# EAGLE schematic boardv2battery (EAGLE 6.6.0)

## Sheet 1 of 4
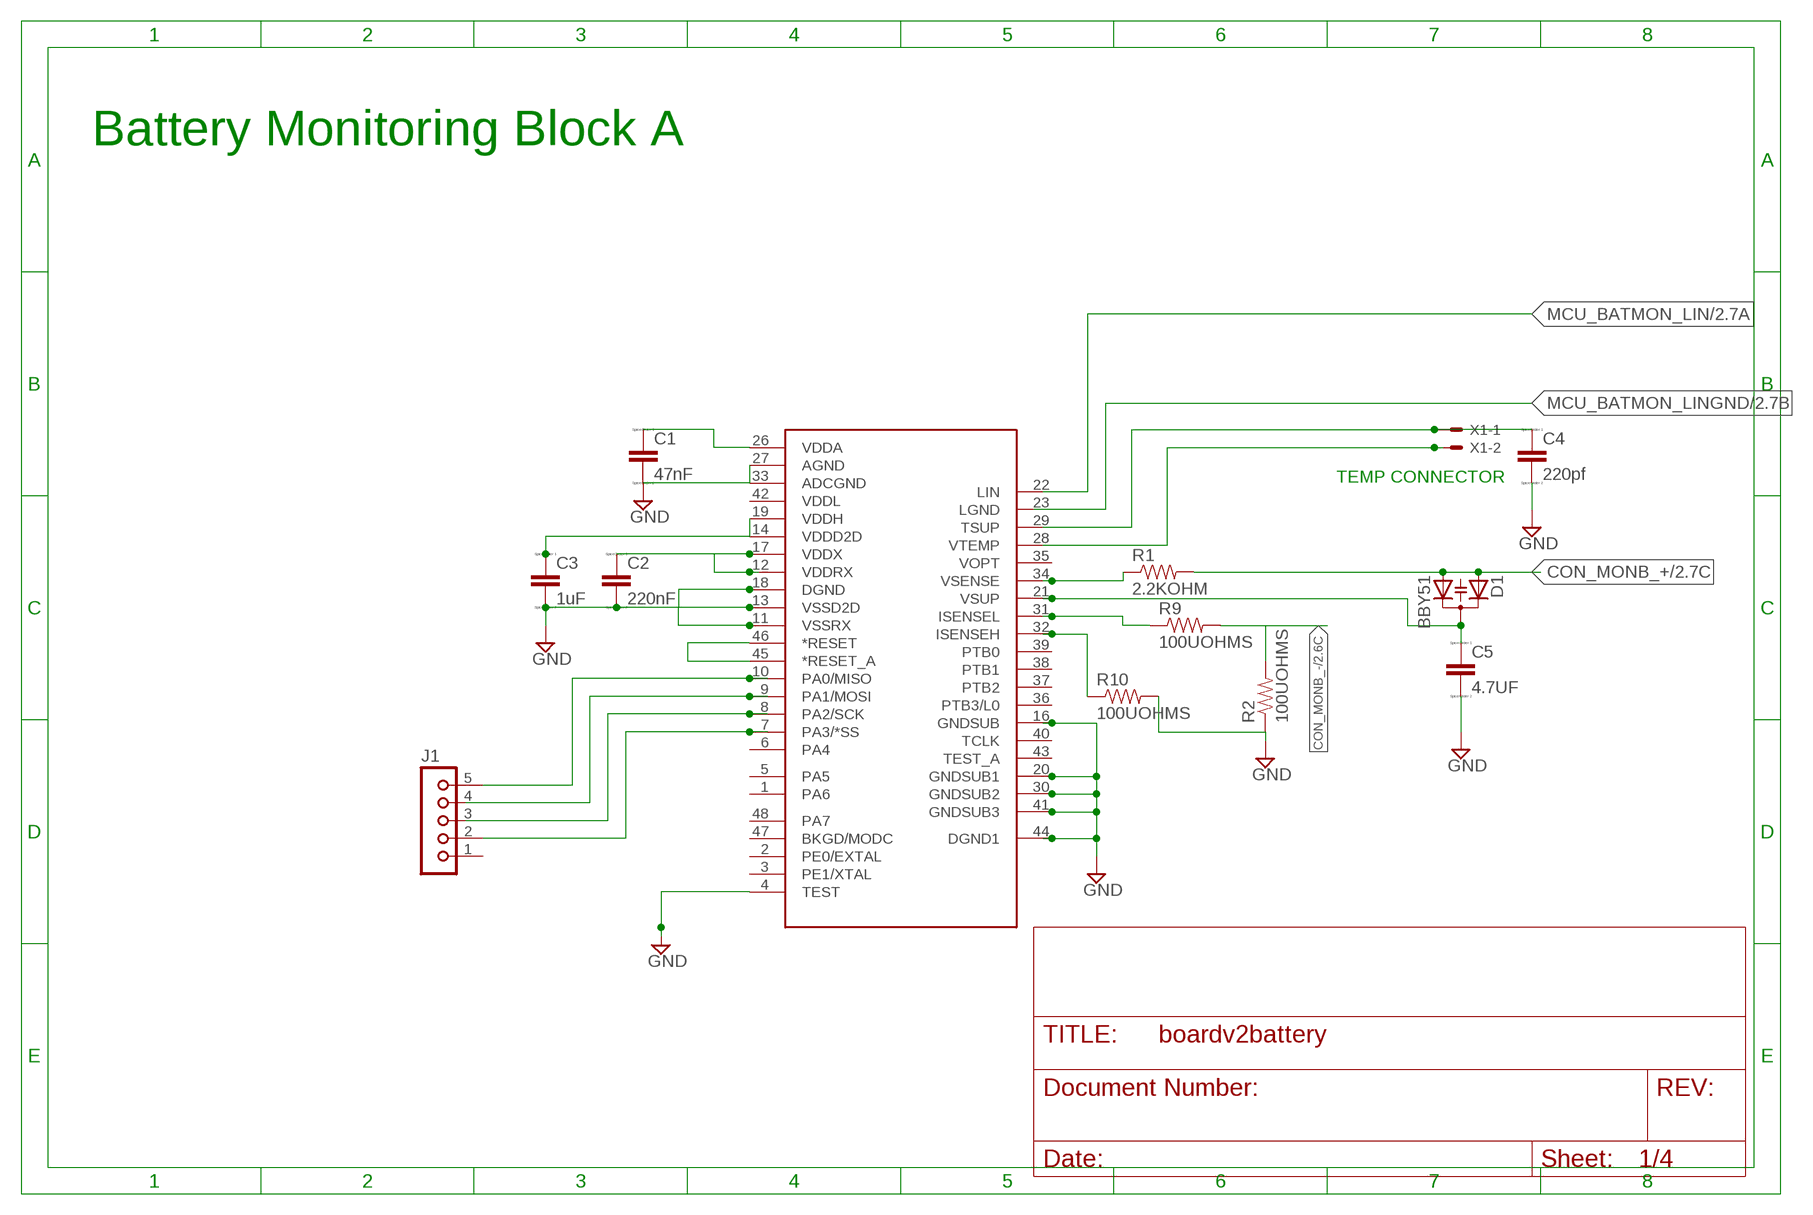
[diagram p0: schematic, sheet 1]

### Parts
C1  47nF  CC0603  [C0603]
C2  220nF  CC0603  [C0603]
C3  1uF  CC0603  [C0603]
C4  220pf  CC0603  [C0603]
C5  4.7UF  CC0603  [C0603]
D1  BBY51  [SOT23]
J1  JU05  [JU05]
R1  2.2KOHM  RESISTOR0603-RES  [0603-RES]
R2  100UOHMS  RESISTOR0603-RES  [0603-RES]
R9  100UOHMS  RESISTOR0603-RES  [0603-RES]
R10  100UOHMS  RESISTOR0603-RES  [0603-RES]
U$1  MM912_637D1  [QFN48]
X1  KK-156-2  [KK-156-2]

### Nets
CON_MONB_+: D1.1(A1) D1.2(A2) R1.2 ; also sheet 2
CON_MONB_-: R2.2 R9.2 ; also sheet 2
GND: C1.2 C2.2 C3.2 C4.2 C5.2 R2.1 R10.2 U$1.4(TEST) U$1.11(VSSRX) U$1.13(VSSD2D) U$1.16(GNDSUB) U$1.18(DGND) U$1.20(GNDSUB1) U$1.27(AGND) U$1.30(GNDSUB2) U$1.41(GNDSUB3) U$1.44(DGND1) ; also sheet 2,3,4
N$2: C2.1 U$1.12(VDDRX) U$1.17(VDDX)
N$3: C5.1 D1.3(C) U$1.21(VSUP)
N$4: J1.5 U$1.10(PA0/MISO)
N$5: U$1.9(PA1/MOSI)
N$6: U$1.8(PA2/SCK)
N$7: J1.2 U$1.7(PA3/*SS)
N$8: U$1.45(*RESET_A) U$1.46(*RESET)
N$10: R1.1 U$1.34(VSENSE)
N$11: C4.1 X1.1
N$12: X1.2
N$45: R10.1 U$1.32(ISENSEH)
N$46: R9.1 U$1.31(ISENSEL)
N$47: C1.1 U$1.26(VDDA)
N$48: C3.1 U$1.14(VDDD2D) U$1.19(VDDH)
Unconnected: J1.1 J1.3 J1.4 U$1.1(PA6) U$1.2(PE0/EXTAL) U$1.3(PE1/XTAL) U$1.5(PA5) U$1.6(PA4) U$1.22(LIN) U$1.23(LGND) U$1.28(VTEMP) U$1.29(TSUP) U$1.33(ADCGND) U$1.35(VOPT) U$1.36(PTB3/L0) U$1.37(PTB2) U$1.38(PTB1) U$1.39(PTB0) U$1.40(TCLK) U$1.42(VDDL) U$1.43(TEST_A) U$1.47(BKGD/MODC) U$1.48(PA7)

### Notes on the sheet
- Battery Monitoring Block A
- TEMP CONNECTOR

## Sheet 2 of 4
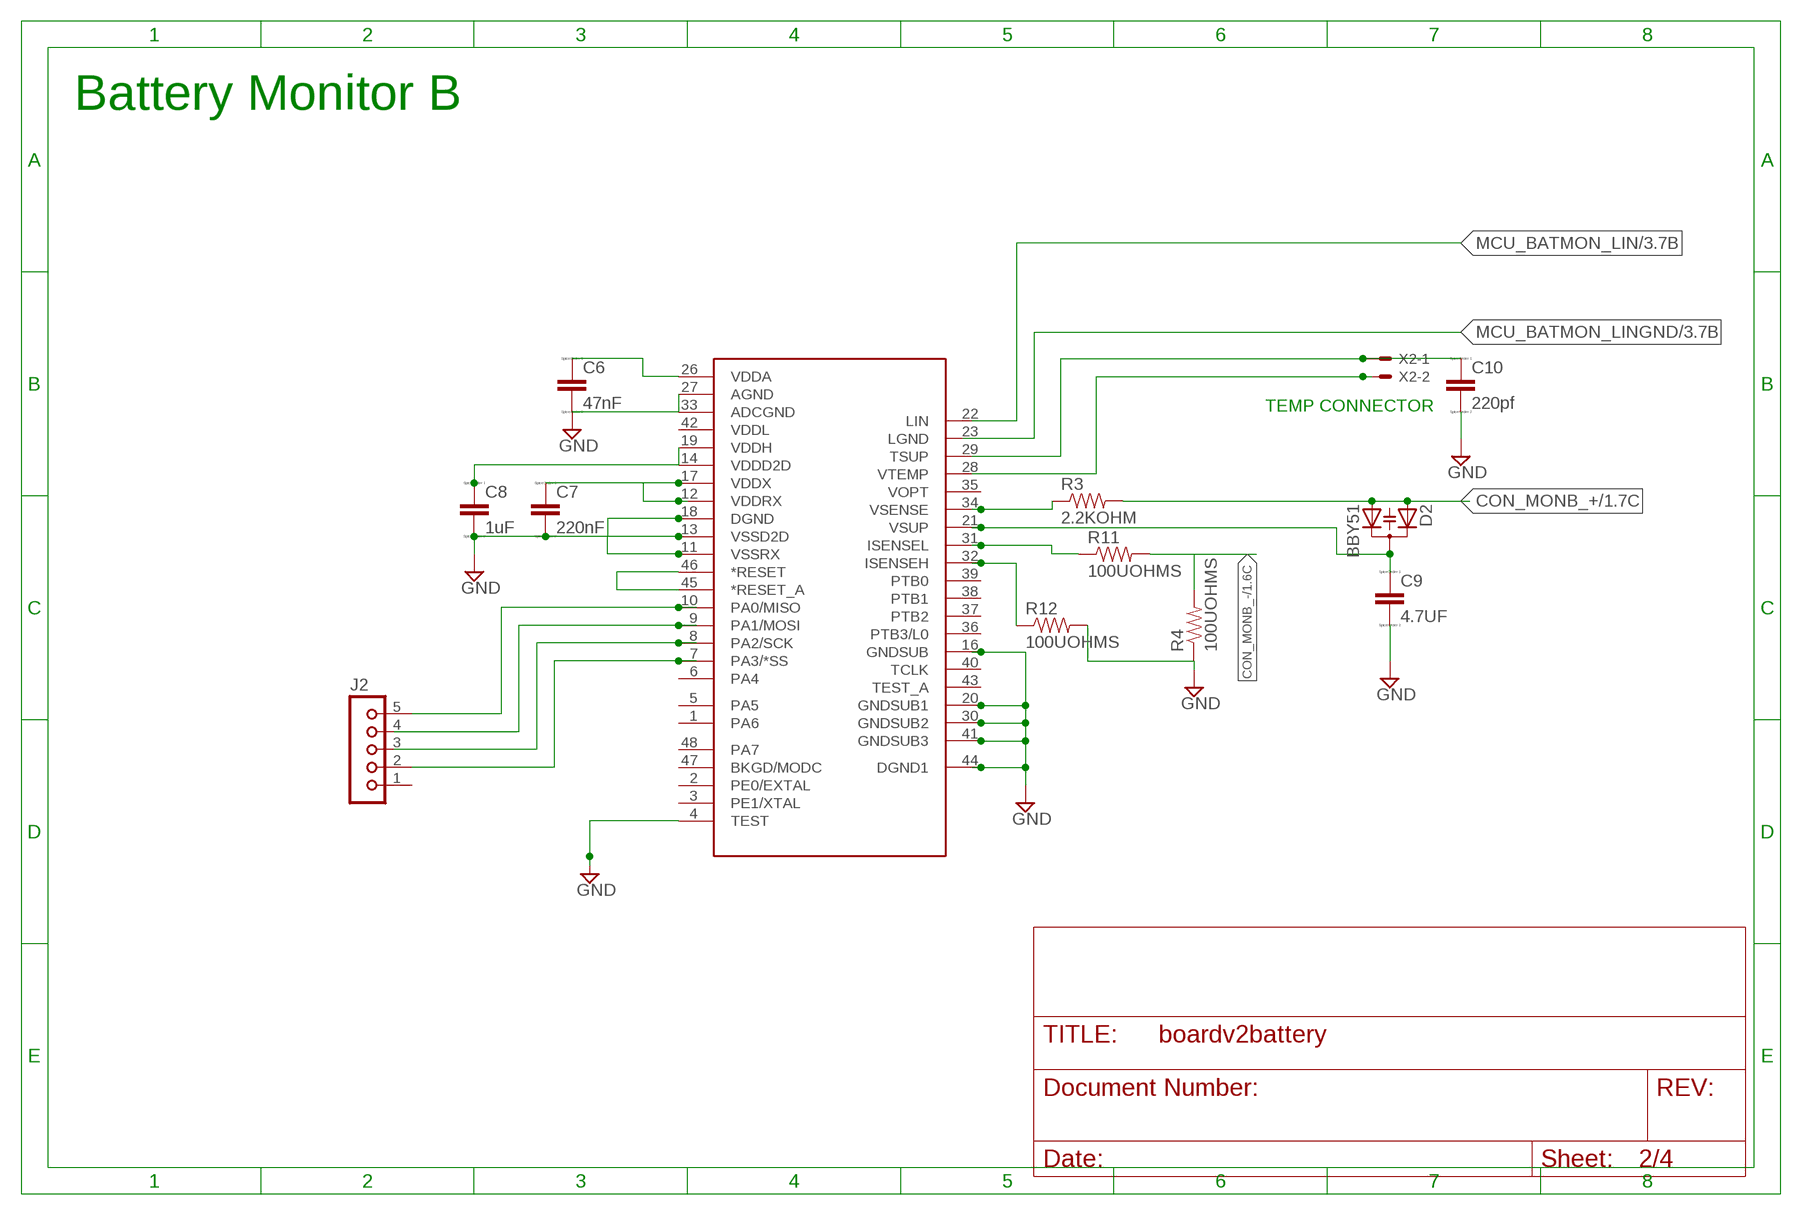
[diagram p1: schematic, sheet 2]

### Parts
C6  47nF  CC0603  [C0603]
C7  220nF  CC0603  [C0603]
C8  1uF  CC0603  [C0603]
C9  4.7UF  CC0603  [C0603]
C10  220pf  CC0603  [C0603]
D2  BBY51  [SOT23]
J2  JU05  [JU05]
R3  2.2KOHM  RESISTOR0603-RES  [0603-RES]
R4  100UOHMS  RESISTOR0603-RES  [0603-RES]
R11  100UOHMS  RESISTOR0603-RES  [0603-RES]
R12  100UOHMS  RESISTOR0603-RES  [0603-RES]
U$2  MM912_637D1  [QFN48]
X2  KK-156-2  [KK-156-2]

### Nets
CON_MONB_+: D2.1(A1) D2.2(A2) R3.2 ; also sheet 1
CON_MONB_-: R4.2 R11.2 ; also sheet 1
GND: C6.2 C7.2 C8.2 C9.2 C10.2 R4.1 R12.2 U$2.4(TEST) U$2.11(VSSRX) U$2.13(VSSD2D) U$2.16(GNDSUB) U$2.18(DGND) U$2.20(GNDSUB1) U$2.27(AGND) U$2.30(GNDSUB2) U$2.41(GNDSUB3) U$2.44(DGND1) ; also sheet 1,3,4
N$1: C9.1 D2.3(C) U$2.21(VSUP)
N$9: J2.5 U$2.10(PA0/MISO)
N$13: U$2.9(PA1/MOSI)
N$14: U$2.8(PA2/SCK)
N$15: J2.2 U$2.7(PA3/*SS)
N$16: R3.1 U$2.34(VSENSE)
N$17: C7.1 U$2.12(VDDRX) U$2.17(VDDX)
N$18: C10.1 X2.1
N$19: X2.2
N$20: U$2.45(*RESET_A) U$2.46(*RESET)
N$21: R12.1 U$2.32(ISENSEH)
N$22: C6.1 U$2.26(VDDA)
N$49: R11.1 U$2.31(ISENSEL)
N$50: C8.1 U$2.14(VDDD2D) U$2.19(VDDH)
Unconnected: J2.1 J2.3 J2.4 U$2.1(PA6) U$2.2(PE0/EXTAL) U$2.3(PE1/XTAL) U$2.5(PA5) U$2.6(PA4) U$2.22(LIN) U$2.23(LGND) U$2.28(VTEMP) U$2.29(TSUP) U$2.33(ADCGND) U$2.35(VOPT) U$2.36(PTB3/L0) U$2.37(PTB2) U$2.38(PTB1) U$2.39(PTB0) U$2.40(TCLK) U$2.42(VDDL) U$2.43(TEST_A) U$2.47(BKGD/MODC) U$2.48(PA7)

### Notes on the sheet
- Battery Monitor B
- TEMP CONNECTOR

## Sheet 3 of 4
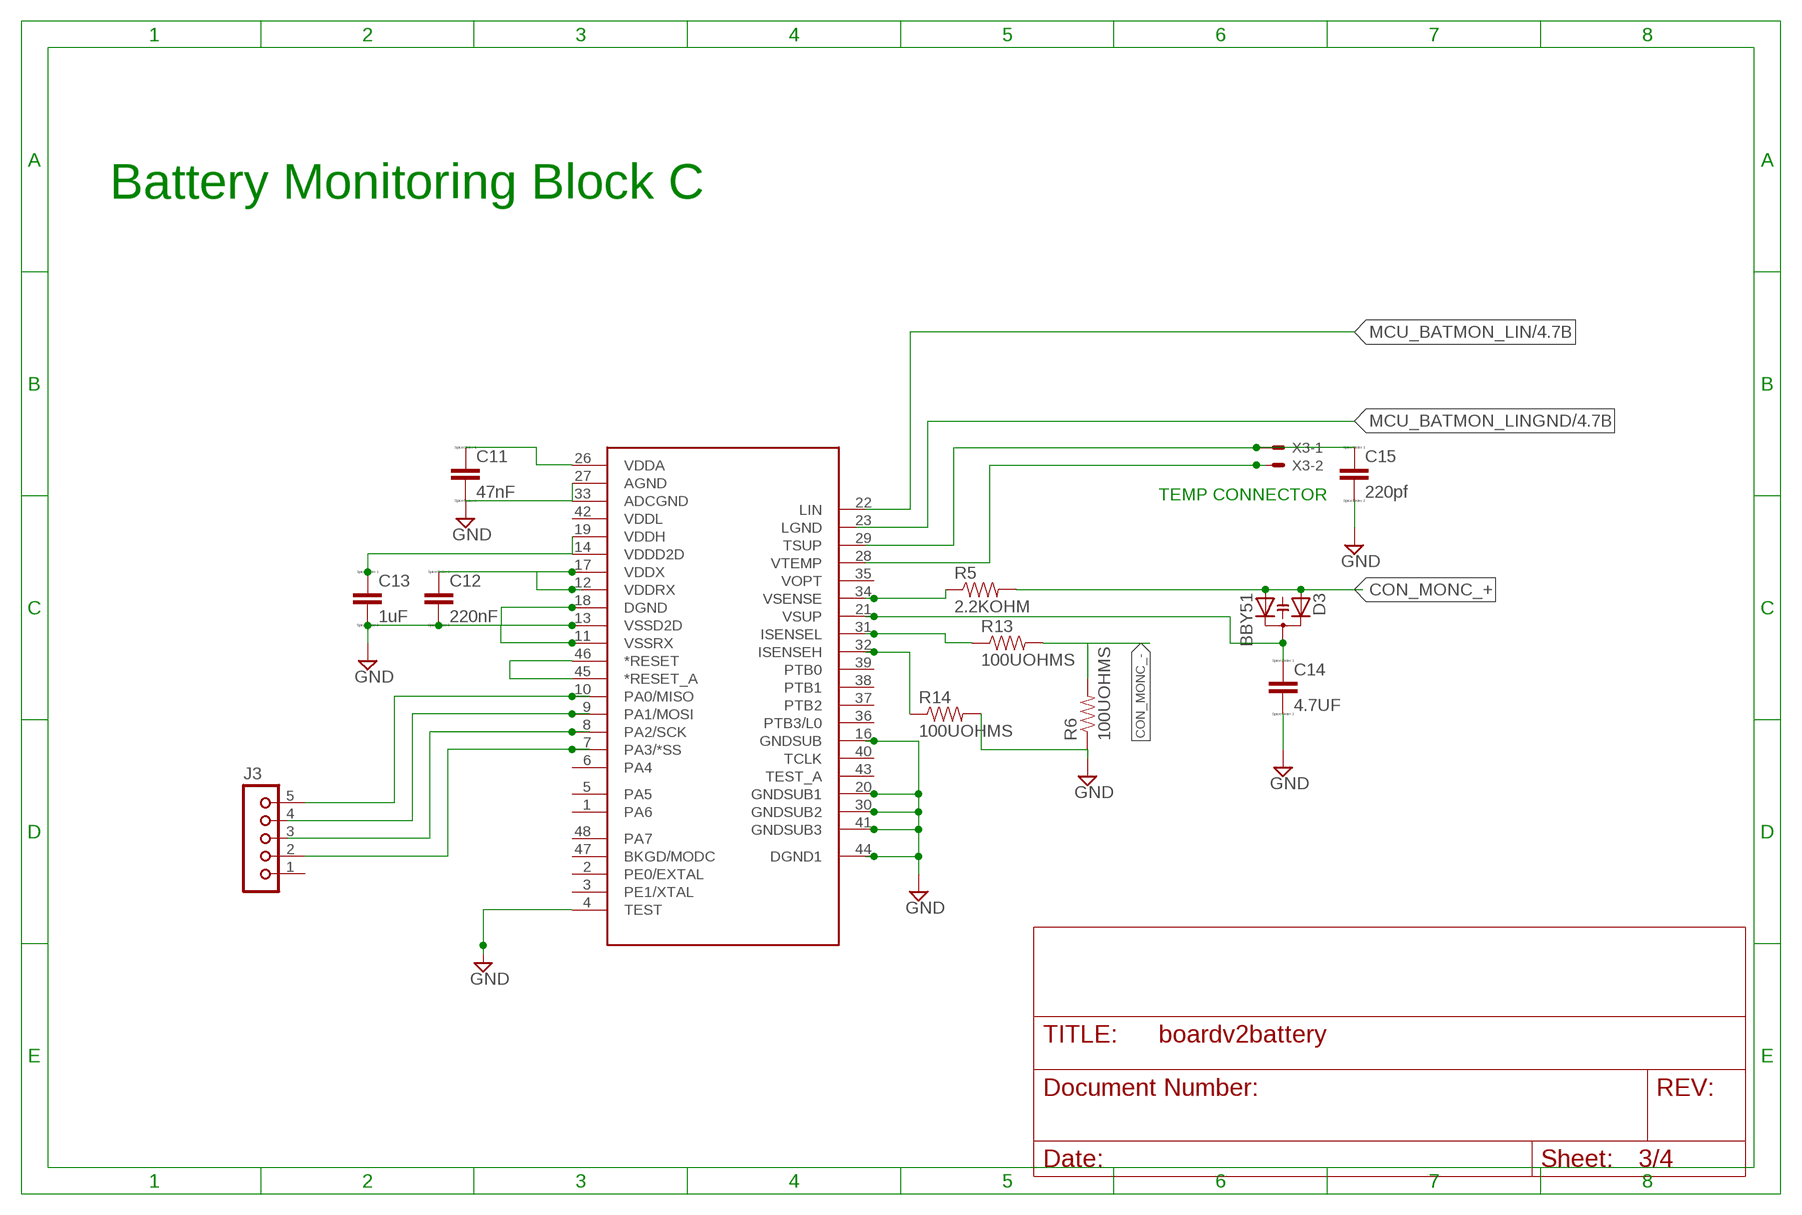
[diagram p2: schematic, sheet 3]

### Parts
C11  47nF  CC0603  [C0603]
C12  220nF  CC0603  [C0603]
C13  1uF  CC0603  [C0603]
C14  4.7UF  CC0603  [C0603]
C15  220pf  CC0603  [C0603]
D3  BBY51  [SOT23]
J3  JU05  [JU05]
R5  2.2KOHM  RESISTOR0603-RES  [0603-RES]
R6  100UOHMS  RESISTOR0603-RES  [0603-RES]
R13  100UOHMS  RESISTOR0603-RES  [0603-RES]
R14  100UOHMS  RESISTOR0603-RES  [0603-RES]
U$3  MM912_637D1  [QFN48]
X3  KK-156-2  [KK-156-2]

### Nets
CON_MONC_+: D3.1(A1) D3.2(A2) R5.2
CON_MONC_-: R6.2 R13.2
GND: C11.2 C12.2 C13.2 C14.2 C15.2 R6.1 R14.2 U$3.4(TEST) U$3.11(VSSRX) U$3.13(VSSD2D) U$3.16(GNDSUB) U$3.18(DGND) U$3.20(GNDSUB1) U$3.27(AGND) U$3.30(GNDSUB2) U$3.41(GNDSUB3) U$3.44(DGND1) ; also sheet 1,2,4
N$23: C14.1 D3.3(C) U$3.21(VSUP)
N$24: J3.5 U$3.10(PA0/MISO)
N$25: U$3.9(PA1/MOSI)
N$26: U$3.8(PA2/SCK)
N$27: J3.2 U$3.7(PA3/*SS)
N$28: R5.1 U$3.34(VSENSE)
N$29: C12.1 U$3.12(VDDRX) U$3.17(VDDX)
N$30: C15.1 X3.1
N$31: X3.2
N$32: U$3.45(*RESET_A) U$3.46(*RESET)
N$33: R14.1 U$3.32(ISENSEH)
N$51: C11.1 U$3.26(VDDA)
N$52: R13.1 U$3.31(ISENSEL)
N$53: C13.1 U$3.14(VDDD2D) U$3.19(VDDH)
Unconnected: J3.1 J3.3 J3.4 U$3.1(PA6) U$3.2(PE0/EXTAL) U$3.3(PE1/XTAL) U$3.5(PA5) U$3.6(PA4) U$3.22(LIN) U$3.23(LGND) U$3.28(VTEMP) U$3.29(TSUP) U$3.33(ADCGND) U$3.35(VOPT) U$3.36(PTB3/L0) U$3.37(PTB2) U$3.38(PTB1) U$3.39(PTB0) U$3.40(TCLK) U$3.42(VDDL) U$3.43(TEST_A) U$3.47(BKGD/MODC) U$3.48(PA7)

### Notes on the sheet
- Battery Monitoring Block C
- TEMP CONNECTOR

## Sheet 4 of 4
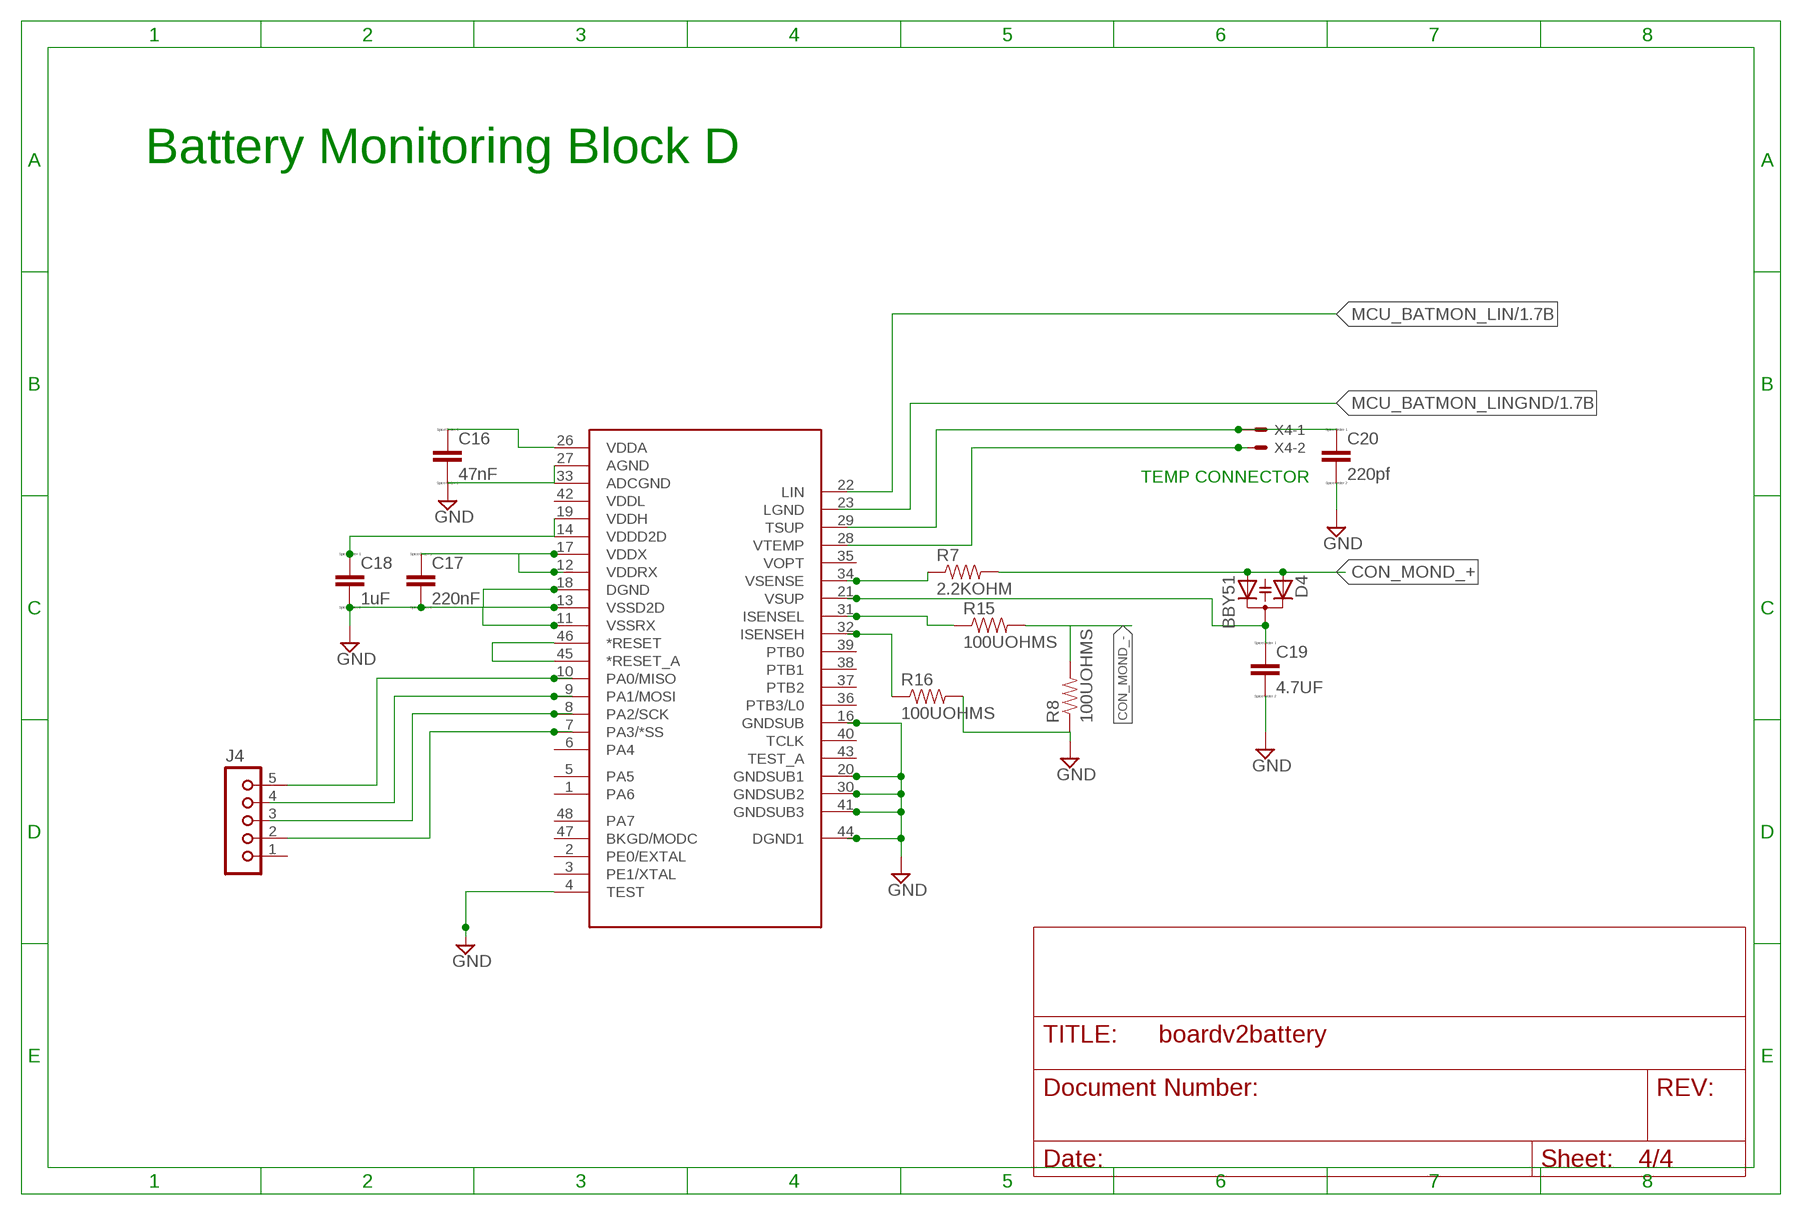
[diagram p3: schematic, sheet 4]

### Parts
C16  47nF  CC0603  [C0603]
C17  220nF  CC0603  [C0603]
C18  1uF  CC0603  [C0603]
C19  4.7UF  CC0603  [C0603]
C20  220pf  CC0603  [C0603]
D4  BBY51  [SOT23]
J4  JU05  [JU05]
R7  2.2KOHM  RESISTOR0603-RES  [0603-RES]
R8  100UOHMS  RESISTOR0603-RES  [0603-RES]
R15  100UOHMS  RESISTOR0603-RES  [0603-RES]
R16  100UOHMS  RESISTOR0603-RES  [0603-RES]
U$4  MM912_637D1  [QFN48]
X4  KK-156-2  [KK-156-2]

### Nets
CON_MOND_+: D4.1(A1) D4.2(A2) R7.2
CON_MOND_-: R8.2 R15.2
GND: C16.2 C17.2 C18.2 C19.2 C20.2 R8.1 R16.2 U$4.4(TEST) U$4.11(VSSRX) U$4.13(VSSD2D) U$4.16(GNDSUB) U$4.18(DGND) U$4.20(GNDSUB1) U$4.27(AGND) U$4.30(GNDSUB2) U$4.41(GNDSUB3) U$4.44(DGND1) ; also sheet 1,2,3
N$34: C19.1 D4.3(C) U$4.21(VSUP)
N$35: J4.5 U$4.10(PA0/MISO)
N$36: U$4.9(PA1/MOSI)
N$37: U$4.8(PA2/SCK)
N$38: J4.2 U$4.7(PA3/*SS)
N$39: R7.1 U$4.34(VSENSE)
N$40: C17.1 U$4.12(VDDRX) U$4.17(VDDX)
N$41: C20.1 X4.1
N$42: X4.2
N$43: U$4.45(*RESET_A) U$4.46(*RESET)
N$44: R16.1 U$4.32(ISENSEH)
N$54: C16.1 U$4.26(VDDA)
N$55: R15.1 U$4.31(ISENSEL)
N$56: C18.1 U$4.14(VDDD2D) U$4.19(VDDH)
Unconnected: J4.1 J4.3 J4.4 U$4.1(PA6) U$4.2(PE0/EXTAL) U$4.3(PE1/XTAL) U$4.5(PA5) U$4.6(PA4) U$4.22(LIN) U$4.23(LGND) U$4.28(VTEMP) U$4.29(TSUP) U$4.33(ADCGND) U$4.35(VOPT) U$4.36(PTB3/L0) U$4.37(PTB2) U$4.38(PTB1) U$4.39(PTB0) U$4.40(TCLK) U$4.42(VDDL) U$4.43(TEST_A) U$4.47(BKGD/MODC) U$4.48(PA7)

### Notes on the sheet
- Battery Monitoring Block D
- TEMP CONNECTOR

## Library data of the parts
C1-C20 = eagle-ltspice:C: CAPACITOR, European symbol; SPICEMODEL: NONE; SPICEPREFIX: C
D1-D4 = diode:BBY51: Capacity DIODE variable-capacitance diode (Infineon)
J1-J4 = con-lsta:JU05: PIN HEADER; OC_FARNELL: unknown; OC_NEWARK: unknown
R1-R16 = SparkFun-Passives:RESISTOR: Resistor Basic schematic elements and footprints for 0603, 1206, and PTH resistors.
U$1-U$4 = freescalemod:MM912_637D1
X1-X4 = con-molex:KK-156-2: KK 156 HEADER Source: http://www.molex.com/pdm_docs/sd/026604100_sd.pdf; OC_FARNELL: unknown; OC_NEWARK: unknown